# Altium project BlackChat Transmitter.PrjPcb
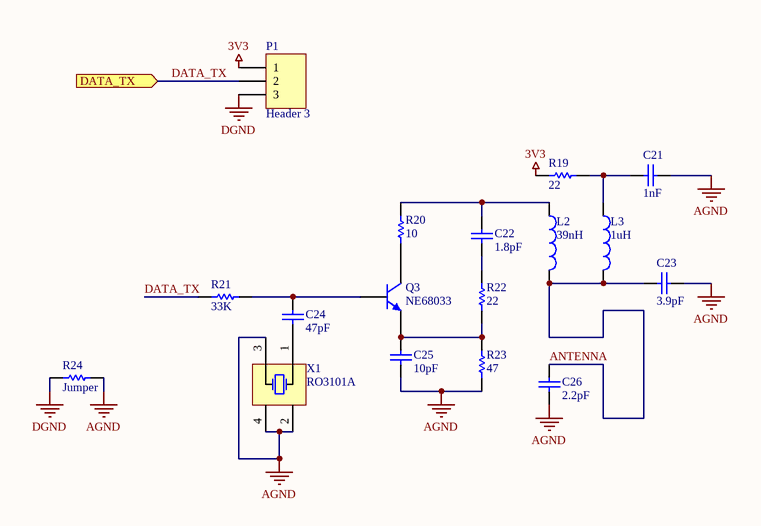
[diagram p0: Transmitter - BlackChat.SchDoc]
1 sheet, 17 parts. Net scope: flat (ports and power ports of the same name join across sheets).
Board file: [R0] Transmitter - BlackChat.PcbDoc

## Sheet Transmitter - BlackChat.SchDoc
size Letter

### Parts
C21  value 1nF  [CAPC0805(2012)100_L]  (hidden comment: CAP 1nF 16V 0805(2012))
C22  value 1.8pF  [CAPC0805(2012)75_L]  (hidden comment: CAP 1.8pF 16V 0805(2012))
C23  value 3.9pF  [CAPC0805(2012)75_N]  (hidden comment: CAP 3.9pF 16V 0805(2012))
C24  value 47pF  [CAPC0805(2012)100_L]  (hidden comment: CAP 47pF 16V 0805(2012))
C25  value 10pF  [CAPC0805(2012)100_L]  (hidden comment: CAP 10pF 16V 0805(2012))
C26  value 2.2pF  [CAPC0805(2012)75_M]  (hidden comment: CAP 2.2pF 16V 0805(2012))
L2  39nH  [C1210]
L3  1uH  [C1210]
P1  Header 3  [HDR1X3]
Q3  NE68033  [SOT95P275X120-3N]
R19  value 22  [RESC0805(2012)_M]  (hidden comment: 22R 5% 0805(2012))
R20  value 10  [RESC0805(2012)_L]  (hidden comment: 10R 5% 0805(2012))
R21  value 33K  [RESC0805(2012)_L]  (hidden comment: 33K 1% 0805(2012))
R22  value 22  [RESC0805(2012)_M]  (hidden comment: 22R 5% 0805(2012))
R23  value 47  [RESC0805(2012)_M]  (hidden comment: 47R 5% 0805(2012))
R24  value Jumper  [RESC0805(2012)_N]  (hidden comment: Jumper 0805(2012))
X1  RO3101A  [RO3101A]

### Ports
DATA_TX (in)

### Nets
3V3: P1.1 R19.2
AGND: C21.1 C23.1 C25.1 C26.2 R23.1 R24.2 X1.2(CASE) X1.3(Terminal_2) X1.4(CASE)
DGND: P1.3 R24.1
ANTENNA: C23.2 C26.1 L2.2 L3.2
DATA_TX: P1.2 R21.2 ; port DATA_TX
NetC21_2: C21.2 L3.1 R19.1
NetC22_1: C22.1 R22.2
NetC22_2: C22.2 L2.1 R20.2
NetC24_1: C24.1 X1.1(Terminal_1)
NetC24_2: C24.2 Q3.2(B) R21.1
NetC25_2: C25.2 Q3.1(E) R22.1 R23.2
NetQ3_3: Q3.3(C) R20.1

### Library data of the parts
C21 = CMP-1036-02955-1: CAP 1nF 16V ±1% 0805 (2012 Metric) Thickness 1mm SMD; Case-EIA: 0805; Case-Metric: 2012; Technology: SMT; Tolerance: ±1%; Max Thickness: 1 mm; Rated Voltage: 16 V
C22 = CMP-1036-00213-1: CAP 1.8pF 16V ±0.1pF 0805 (2012 Metric) Thickness 0.75mm SMD; Case-Metric: 2012; Case-EIA: 0805; Rated Voltage: 16 V; Tolerance: ±0.1pF; Max Thickness: 0.75 mm; Technology: SMT
C23 = CMP-1036-00461-1: CAP 3.9pF 16V ±0.1pF 0805 (2012 Metric) Thickness 0.75mm SMD; Case-Metric: 2012; Case-EIA: 0805; Rated Voltage: 16 V; Tolerance: ±0.1pF; Technology: SMT; Max Thickness: 0.75 mm
C24 = CMP-1036-01589-1: CAP 47pF 16V ±0.5pF 0805 (2012 Metric) Thickness 1mm SMD; Case-Metric: 2012; Case-EIA: 0805; Technology: SMT; Rated Voltage: 16 V; Tolerance: ±0.5pF; Max Thickness: 1 mm
C25 = CMP-1036-00830-1: CAP 10pF 16V ±0.25pF 0805 (2012 Metric) Thickness 1mm SMD; Case-EIA: 0805; Case-Metric: 2012; Max Thickness: 1 mm; Tolerance: ±0.25pF; Rated Voltage: 16 V; Technology: SMT
C26 = CMP-1036-00267-1: CAP 2.2pF 16V ±0.1pF 0805 (2012 Metric) Thickness 0.75mm SMD; Case-Metric: 2012; Case-EIA: 0805; Technology: SMT; Rated Voltage: 16 V; Tolerance: ±0.1pF; Max Thickness: 0.75 mm
L2 L3 = Inductor: Generic Inductor
  L2: Value: 39nH
  L3: Value: 1uH
P1 = Header 3: Header, 3-Pin; LatestRevisionDate: 17-Jul-2002; LatestRevisionNote: Re-released for DXP Platform.; Publisher: Altium Limited
Q3 = NE68033: NPN SILICON HIGH FREQUENCY TRANSISTOR
R19 R22 = CMP-1013-00034-1: 22R 0.125W 5% 0805 (2012 Metric)  SMD; Case-Metric: 2012; Case-EIA: 0805; Power: 0.125 W; Technology: SMT; Tolerance: 5 %
R20 = CMP-1013-00026-1: 10R 0.125W 5% 0805 (2012 Metric)  SMD; Case-EIA: 0805; Case-Metric: 2012; Technology: SMT; Power: 0.125 W; Tolerance: 5 %
R21 = CMP-1013-00680-1: 33K 0.125W 1% 0805 (2012 Metric)  SMD; Case-EIA: 0805; Case-Metric: 2012; Technology: SMT; Tolerance: 1 %; Power: 0.125 W
R23 = CMP-1013-00042-1: 47R 0.125W 5% 0805 (2012 Metric)  SMD; Case-Metric: 2012; Case-EIA: 0805; Tolerance: 5 %; Power: 0.125 W; Technology: SMT
R24 = CMP-1013-00001-1: Jumper 0805 (2012 Metric); Case-EIA: 0805; Tolerance: None; Case-Metric: 2012; Technology: SMT; Power: None
X1 = RO3101A: 433.92 MHz  SAW  Resonator; ComponentLink1Description: Datasheet; ComponentLink1URL: http://www.mouser.com/catalog/specsheets/ro3101a1.pdf